# EAGLE design hemisphere_robo (EAGLE 8.2.2)
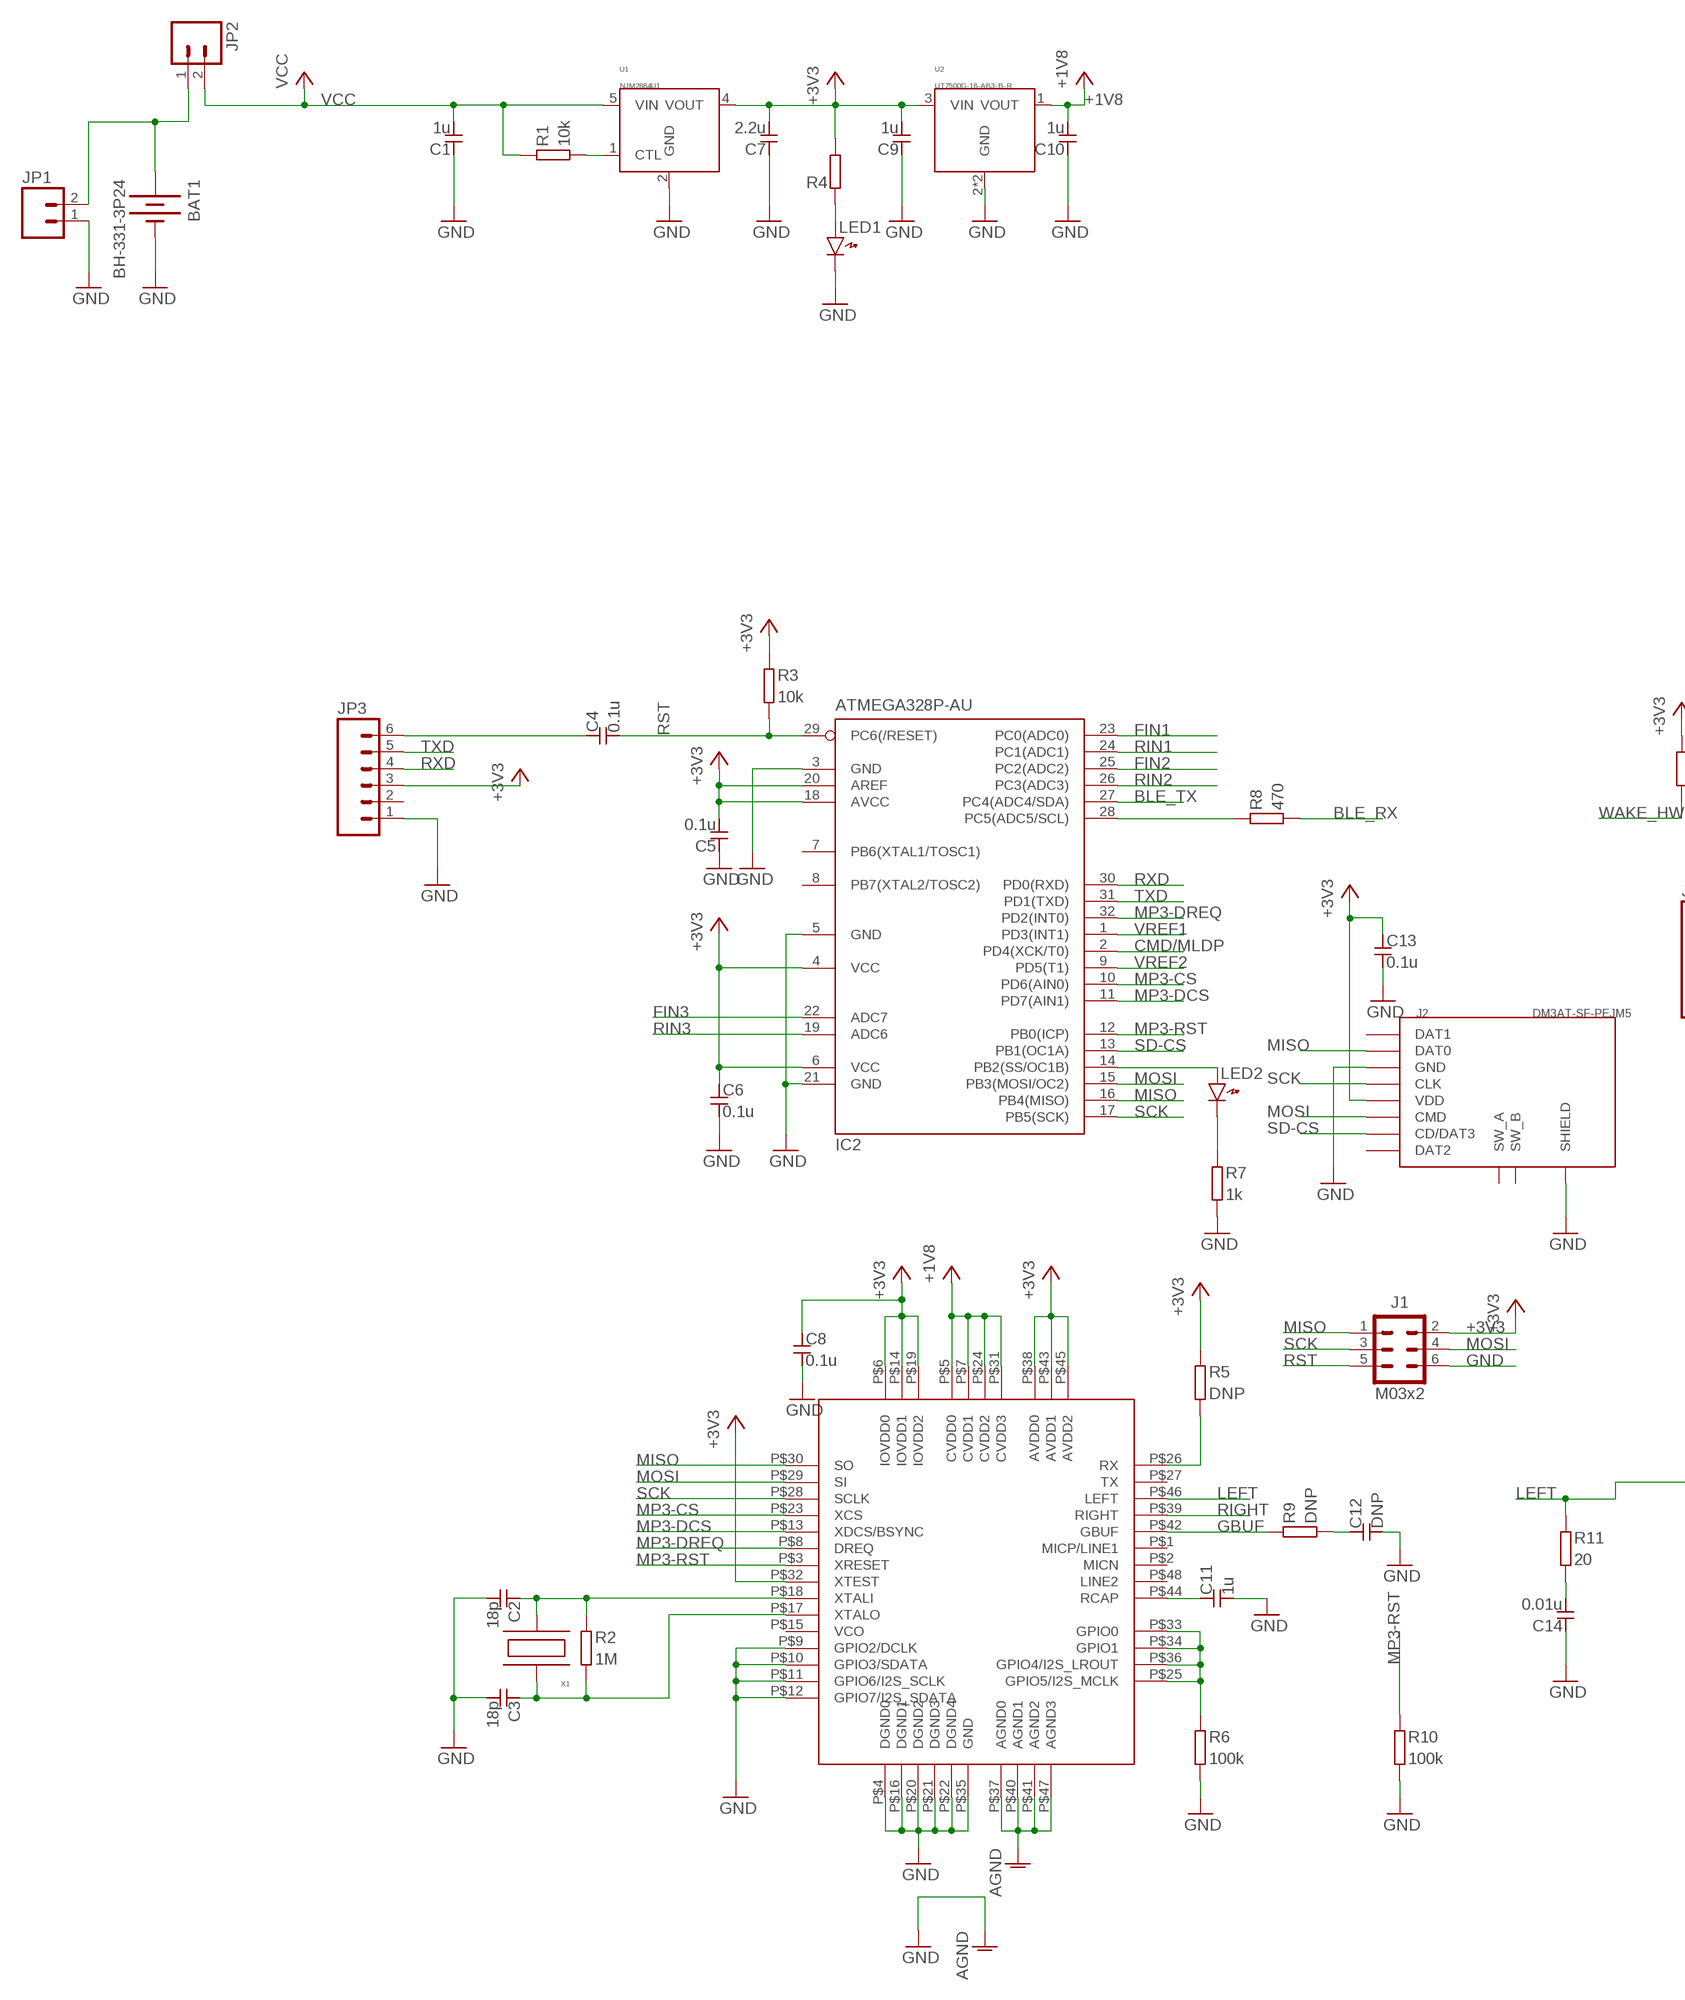
[diagram p0: schematic, sheet 1, part 1 of 2]
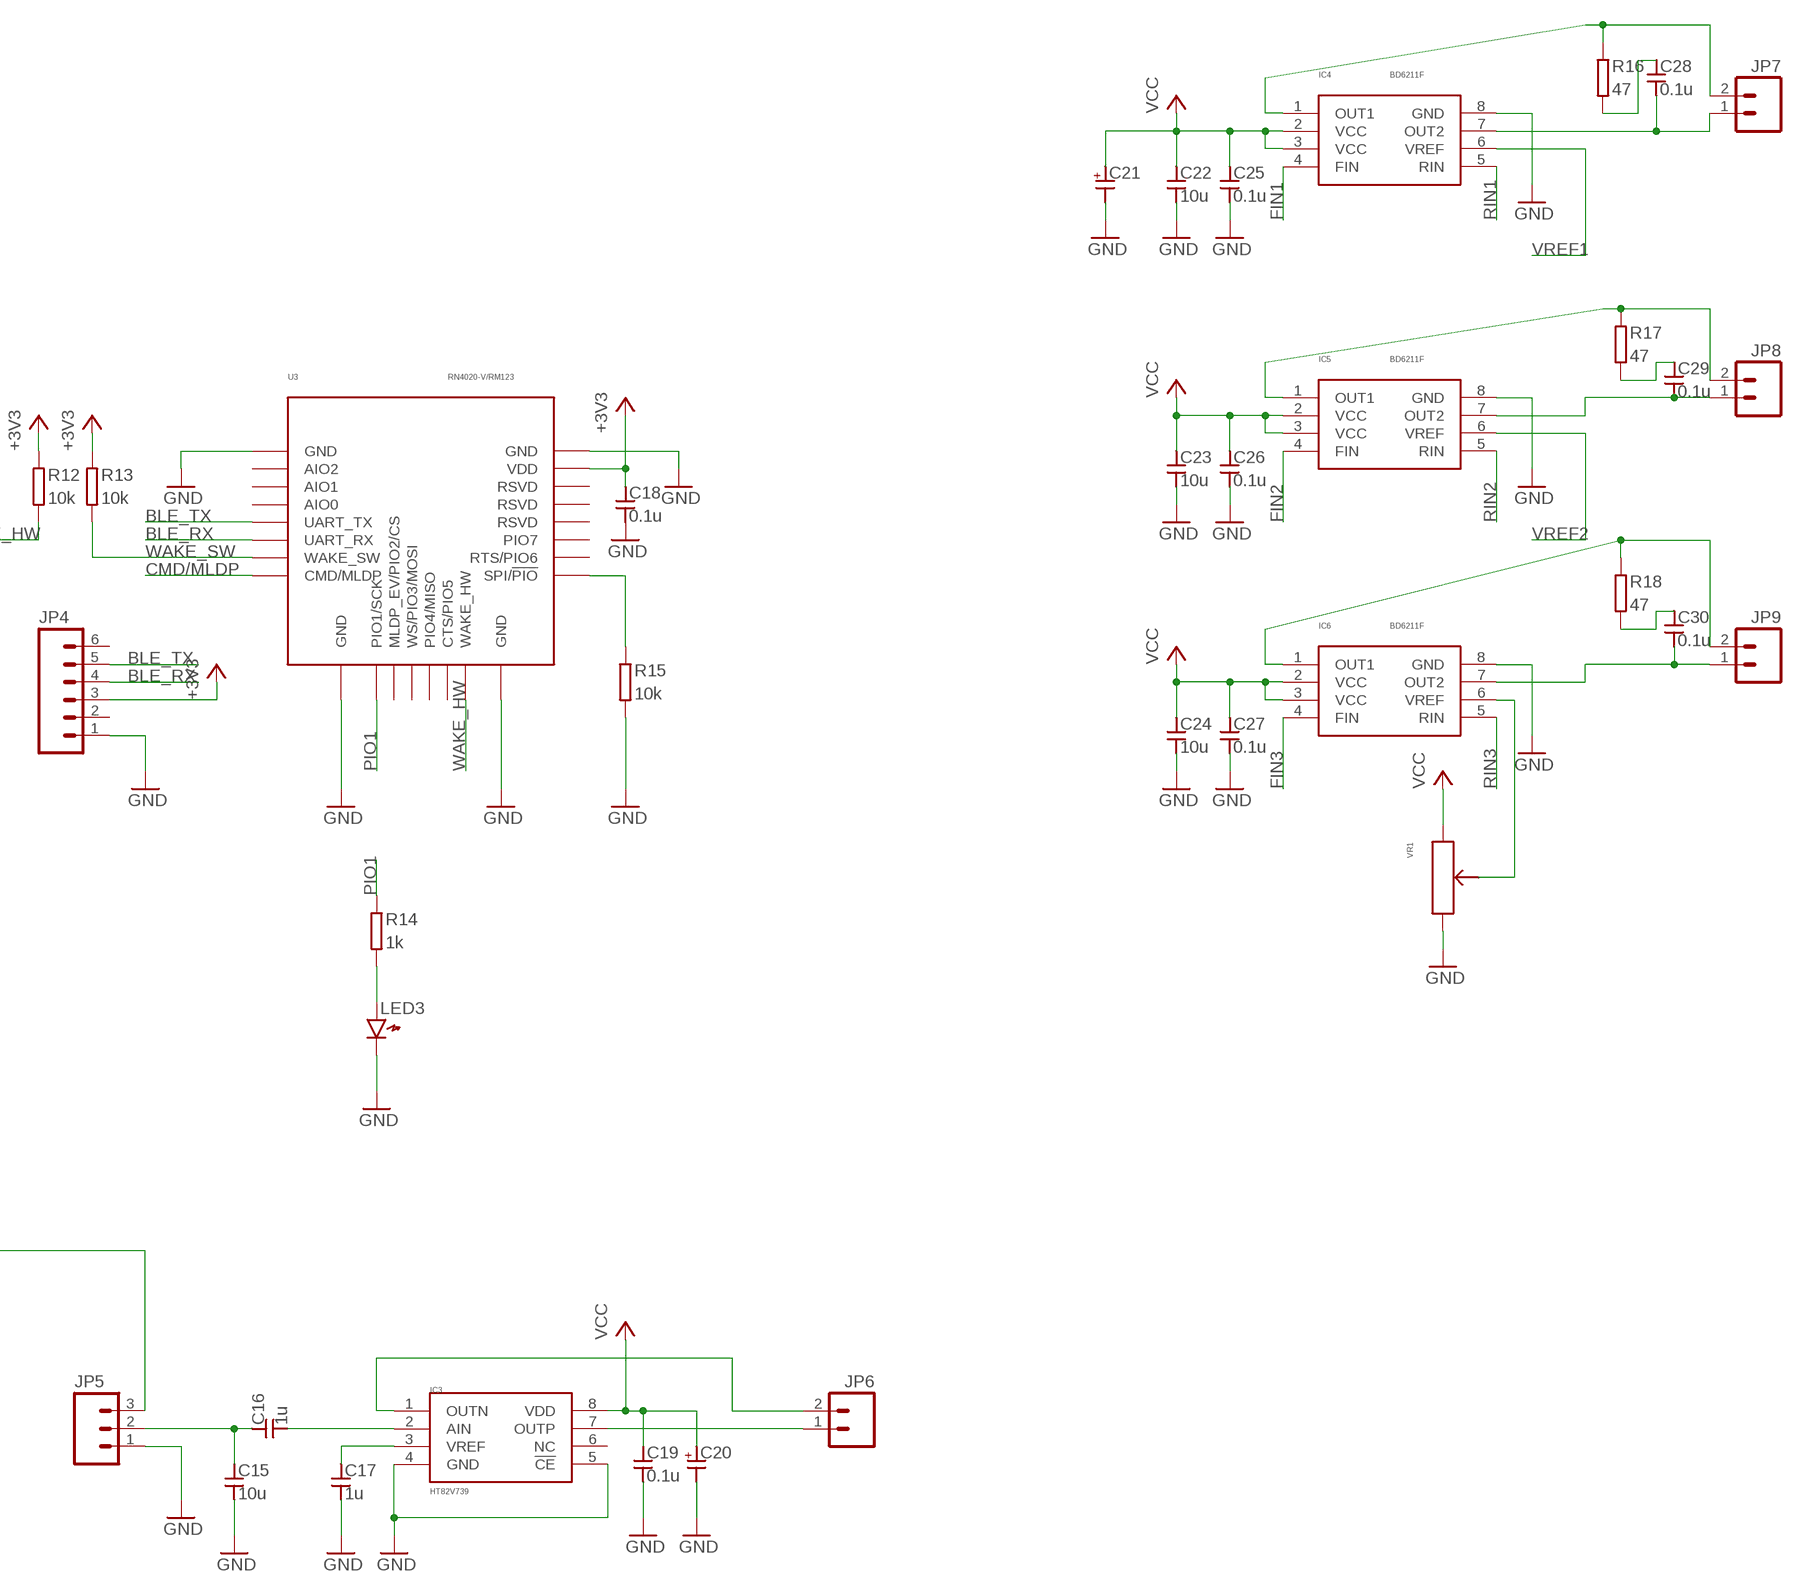
[diagram p1: schematic, sheet 1, part 2 of 2]

## Parts
BAT1  BH-331-3P24  [BH-331-3P24]
C1  1u  CAPACITOR1608_REDUCED  [SMD1608_REDUCED]
C2  18p  CAPACITOR1608_REDUCED  [SMD1608_REDUCED]
C3  18p  CAPACITOR1608_REDUCED  [SMD1608_REDUCED]
C4  0.1u  CAPACITOR1608_REDUCED  [SMD1608_REDUCED]
C5  0.1u  CAPACITOR1608_REDUCED  [SMD1608_REDUCED]
C6  0.1u  CAPACITOR1608_REDUCED  [SMD1608_REDUCED]
C7  2.2u  CAPACITOR1608_REDUCED  [SMD1608_REDUCED]
C8  0.1u  CAPACITOR1608_REDUCED  [SMD1608_REDUCED]
C9  1u  CAPACITOR1608_REDUCED  [SMD1608_REDUCED]
C10  1u  CAPACITOR1608_REDUCED  [SMD1608_REDUCED]
C11  1u  CAPACITOR1608_REDUCED  [SMD1608_REDUCED]
C12  DNP  CAPACITOR1608_REDUCED  [SMD1608_REDUCED]
C13  0.1u  CAPACITOR1608_REDUCED  [SMD1608_REDUCED]
C14  0.01u  CAPACITOR1608_REDUCED  [SMD1608_REDUCED]
C15  10u  CAPACITOR2012_REDUCED  [SMD2012_REDUCED]
C16  1u  CAPACITOR1608_REDUCED  [SMD1608_REDUCED]
C17  1u  CAPACITOR1608_REDUCED  [SMD1608_REDUCED]
C18  0.1u  CAPACITOR1608_REDUCED  [SMD1608_REDUCED]
C19  0.1u  CAPACITOR1608_REDUCED  [SMD1608_REDUCED]
C20  CAPACITOR-POLPANASONIC_D  [PANASONIC_D]
C21  CAPACITOR-POLPANASONIC_D  [PANASONIC_D]
C22  10u  CAPACITOR2012_REDUCED  [SMD2012_REDUCED]
C23  10u  CAPACITOR2012_REDUCED  [SMD2012_REDUCED]
C24  10u  CAPACITOR2012_REDUCED  [SMD2012_REDUCED]
C25  0.1u  CAPACITOR1608_REDUCED  [SMD1608_REDUCED]
C26  0.1u  CAPACITOR1608_REDUCED  [SMD1608_REDUCED]
C27  0.1u  CAPACITOR1608_REDUCED  [SMD1608_REDUCED]
C28  0.1u  CAPACITOR1608_REDUCED  [SMD1608_REDUCED]
C29  0.1u  CAPACITOR1608_REDUCED  [SMD1608_REDUCED]
C30  0.1u  CAPACITOR1608_REDUCED  [SMD1608_REDUCED]
IC1  VS1053B  [LQFP48]
IC2  ATMEGA328P-AU  [TQFP32-08]
IC3  HT82V739  [DIP8]
IC4  BD6211F  [SOP-8]
IC5  BD6211F  [SOP-8]
IC6  BD6211F  [SOP-8]
J1  M03X2STD  [2X03]
J2  DM3AT-SF-PEJM5  [DM3AT-SF-PEJM5]
JP1  M02NOSILK  [1X02-NOSILK]
JP2  M02NOSILK  [1X02-NOSILK]
JP3  M06NOSILK  [1X06-NOSILK]
JP4  M06NOSILK  [1X06-NOSILK]
JP5  M03NOSILK  [1X03-NOSILK]
JP6  M02NOSILK  [1X02-NOSILK]
JP7  M02NOSILK  [1X02-NOSILK]
JP8  M02NOSILK  [1X02-NOSILK]
JP9  M02NOSILK  [1X02-NOSILK]
LED1  LED1608_REDUCED  [LED1608_REDUCED]
LED2  LED1608_REDUCED  [LED1608_REDUCED]
LED3  LED1608_REDUCED  [LED1608_REDUCED]
R1  10k  RESISTOR1608_REDUCED  [SMD1608_REDUCED]
R2  1M  RESISTOR1608_REDUCED  [SMD1608_REDUCED]
R3  10k  RESISTOR1608_REDUCED  [SMD1608_REDUCED]
R4  RESISTOR1608_REDUCED  [SMD1608_REDUCED]
R5  DNP  RESISTOR1608_REDUCED  [SMD1608_REDUCED]
R6  100k  RESISTOR1608_REDUCED  [SMD1608_REDUCED]
R7  1k  RESISTOR1608_REDUCED  [SMD1608_REDUCED]
R8  470  RESISTOR1608_REDUCED  [SMD1608_REDUCED]
R9  DNP  RESISTOR1608_REDUCED  [SMD1608_REDUCED]
R10  100k  RESISTOR1608_REDUCED  [SMD1608_REDUCED]
R11  20  RESISTOR1608_REDUCED  [SMD1608_REDUCED]
R12  10k  RESISTOR1608_REDUCED  [SMD1608_REDUCED]
R13  10k  RESISTOR1608_REDUCED  [SMD1608_REDUCED]
R14  1k  RESISTOR1608_REDUCED  [SMD1608_REDUCED]
R15  10k  RESISTOR1608_REDUCED  [SMD1608_REDUCED]
R16  47  RESISTOR1608_REDUCED  [SMD1608_REDUCED]
R17  47  RESISTOR1608_REDUCED  [SMD1608_REDUCED]
R18  47  RESISTOR1608_REDUCED  [SMD1608_REDUCED]
U1  NJM2884U1  [SOT-89-5]
U2  UT7500G-18-AB3-B-R  [SOT-89]
U3  RN4020-V/RM123  [RN4020]
VR1  VR  [3362P]
X1  ABM2  [ABM2]

## Nets
+1V8: C10.2 IC1.P$5(CVDD0) IC1.P$7(CVDD1) IC1.P$24(CVDD2) IC1.P$31(CVDD3) U2.1(VOUT)
+3V3: C5.2 C6.1 C7.2 C8.1 C9.2 C13.1 C18.1 IC1.P$6(IOVDD0) IC1.P$14(IOVDD1) IC1.P$19(IOVDD2) IC1.P$32(XTEST) IC1.P$38(AVDD0) IC1.P$43(AVDD1) IC1.P$45(AVDD2) IC2.4(VCC) IC2.6(VCC) IC2.18(AVCC) IC2.20(AREF) J1.2 J2.4(VDD)(VDD) JP3.3 JP4.3 R3.1 R4.2 R5.1 R12.1 R13.1 U1.4(VOUT) U2.3(VIN) U3.23(VDD)
BLE_RX: JP4.4 R8.2 U3.6(UART_RX)
BLE_TX: IC2.27(PC4(ADC4/SDA)) JP4.5 U3.5(UART_TX)
CMD/MLDP: IC2.2(PD4(XCK/T0)) U3.8(CMD/MLDP)
FIN1: IC2.23(PC0(ADC0)) IC4.4(FIN)
FIN2: IC2.25(PC2(ADC2)) IC5.4(FIN)
FIN3: IC2.22(ADC7) IC6.4(FIN)
GBUF: IC1.P$42(GBUF) R9.1
GND: BAT1.- C1.1 C2.2 C3.2 C5.1 C6.2 C7.1 C8.2 C9.1 C10.1 C11.2 C12.2 C13.2 C14.1 C15.2 C17.2 C18.2 C19.2 C20.- C21.- C22.2 C23.2 C24.2 C25.2 C26.2 C27.2 IC1.P$4(DGND0) IC1.P$9(GPIO2/DCLK) IC1.P$10(GPIO3/SDATA) IC1.P$11(GPIO6/I2S_SCLK) IC1.P$12(GPIO7/I2S_SDATA) IC1.P$16(DGND1) IC1.P$20(DGND2) IC1.P$21(DGND3) IC1.P$22(DGND4) IC1.P$35(GND) IC1.P$37(AGND0) IC1.P$40(AGND1) IC1.P$41(AGND2) IC1.P$47(AGND3) IC2.3(GND) IC2.5(GND) IC2.21(GND) IC3.4(GND) IC3.5(!CE) IC4.8(GND) IC5.8(GND) IC6.8(GND) J1.6 J2.6(GND)(GND) J2.SHIELD@1(SHIELD) J2.SHIELD@2(SHIELD) J2.SHIELD@3(SHIELD) J2.SHIELD@4(SHIELD) JP1.1 JP3.1 JP4.1 JP5.1 LED1.K LED3.K R6.2 R7.2 R10.2 R15.2 U1.2(GND) U2.2(GND) U2.4(GND) U3.1(GND) U3.9(GND) U3.16(GND) U3.24(GND) VR1.3 ; supply symbol labelled AGND
LEFT: IC1.P$46(LEFT) JP5.3 R11.1
MISO: IC1.P$30(SO) IC2.16(PB4(MISO)) J1.1 J2.7(DAT0)(DAT0)
MOSI: IC1.P$29(SI) IC2.15(PB3(MOSI/OC2)) J1.4 J2.3(CMD)(CMD)
MP3-CS: IC1.P$23(XCS) IC2.10(PD6(AIN0))
MP3-DCS: IC1.P$13(XDCS/BSYNC) IC2.11(PD7(AIN1))
MP3-DREQ: IC1.P$8(DREQ) IC2.32(PD2(INT0))
MP3-RST: IC1.P$3(XRESET) IC2.12(PB0(ICP)) R10.1
N$1: IC2.14(PB2(SS/OC1B)) LED2.A
N$2: C4.1 JP3.6
N$3: LED3.A R14.2
N$4: IC2.28(PC5(ADC5/SCL)) R8.1
N$5: IC6.1(OUT1) JP9.2 R18.1
N$6: IC1.P$25(GPIO5/I2S_MCLK) IC1.P$33(GPIO0) IC1.P$34(GPIO1) IC1.P$36(GPIO4/I2S_LROUT) R6.1
N$10: C11.1 IC1.P$44(RCAP)
N$11: R15.1 U3.17(SPI/!PIO)
N$12: IC1.P$26(RX) R5.2
N$13: BAT1.+ JP1.2 JP2.1
N$14: IC3.7(OUTP) JP6.1
N$15: C2.1 IC1.P$18(XTALI) R2.1 X1.2
N$16: C14.2 R11.2
N$17: C12.1 R9.2
N$18: R1.2 U1.1(CTL)
N$19: C3.1 IC1.P$17(XTALO) R2.2 X1.1
N$20: C30.2 IC6.7(OUT2) JP9.1
N$21: IC6.6(VREF) VR1.2
N$22: C17.1 IC3.3(VREF)
N$23: C16.2 IC3.2(AIN)
N$24: C15.1 C16.1 JP5.2
N$25: C28.1 R16.2
N$26: C29.1 R17.2
N$27: C30.1 R18.2
N$29: IC3.1(OUTN) JP6.2
N$31: LED1.A R4.1
N$37: IC5.1(OUT1) JP8.2 R17.1
N$38: C29.2 IC5.7(OUT2) JP8.1
N$39: IC4.1(OUT1) JP7.2 R16.1
N$40: C28.2 IC4.7(OUT2) JP7.1
PIO1: R14.1 U3.10(PIO1/SCK)
RIGHT: IC1.P$39(RIGHT)
RIN1: IC2.24(PC1(ADC1)) IC4.5(RIN)
RIN2: IC2.26(PC3(ADC3)) IC5.5(RIN)
RIN3: IC2.19(ADC6) IC6.5(RIN)
RST: C4.2 IC2.29(PC6(/RESET)) J1.5 R3.2
RXD: IC2.30(PD0(RXD)) JP3.4
SCK: IC1.P$28(SCLK) IC2.17(PB5(SCK)) J1.3 J2.5(CLK)(CLK)
SD-CS: IC2.13(PB1(OC1A)) J2.2(CD/DAT3)(CD/DAT3)
SHUTDOWN: LED2.K R7.1
TXD: IC2.31(PD1(TXD)) JP3.5
VCC: C1.2 C19.1 C20.+ C21.+ C22.1 C23.1 C24.1 C25.1 C26.1 C27.1 IC3.8(VDD) IC4.2(VCC) IC4.3(VCC) IC5.2(VCC) IC5.3(VCC) IC6.2(VCC) IC6.3(VCC) JP2.2 R1.1 U1.5(VIN) VR1.1
VREF1: IC2.1(PD3(INT1)) IC4.6(VREF)
VREF2: IC2.9(PD5(T1)) IC5.6(VREF)
WAKE_HW: R12.2 U3.15(WAKE_HW)
WAKE_SW: R13.2 U3.7(WAKE_SW)
Unconnected: IC1.P$1(MICP/LINE1) IC1.P$2(MICN) IC1.P$15(VCO) IC1.P$27(TX) IC1.P$48(LINE2) IC2.7(PB6(XTAL1/TOSC1)) IC2.8(PB7(XTAL2/TOSC2)) IC3.6(NC) J2.1(DAT2)(DAT2) J2.8(DAT1)(DAT1) J2.SW_A J2.SW_B JP3.2 JP4.2 JP4.6 U3.2(AIO2) U3.3(AIO1) U3.4(AIO0) U3.11(MLDP_EV/PIO2/CS) U3.12(WS/PIO3/MOSI) U3.13(PIO4/MISO) U3.14(CTS/PIO5) U3.18(RTS/PIO6) U3.19(PIO7) U3.20(RSVD) U3.21(RSVD) U3.22(RSVD)

## Library data of the parts
BAT1 = battery:BH-331-3P24
C1-C19 C22-C30 = generic:CAPACITOR: Generic Capacitor
C20 C21 = generic:CAPACITOR-POL: Generic Capacitor with Polarity
IC1 = MP3:VS1053B
IC2 = AVR:ATMEGA328P-AU: AVR ATMEGA328P-AU AKIZUKI CODE I-04386
IC3 = audio_amp:HT82V739
IC4-IC6 = motor_driver:BD6211: ROHM Motor driver
J1 = header:M03X2
J2 = SDcard:DM3AT
JP1 JP2 JP6-JP9 = header:M02
JP3 JP4 = header:M06
JP5 = header:M03
LED1-LED3 = generic:LED: Generic LEDs
R1-R18 = generic:RESISTOR: Generic Registor
U1 = LDO:NJM2884U1: JRC LDO Io(max ) = 500mA akizuki : I-10896
U2 = LDO:UT7500G: LDO Io: 100mA
U3 = com_module:RN4020: Bluetooth Low Energy Module Microchip
VR1 = VR:VR
X1 = crystal:ABM2: ABRACON Crystal

## Board
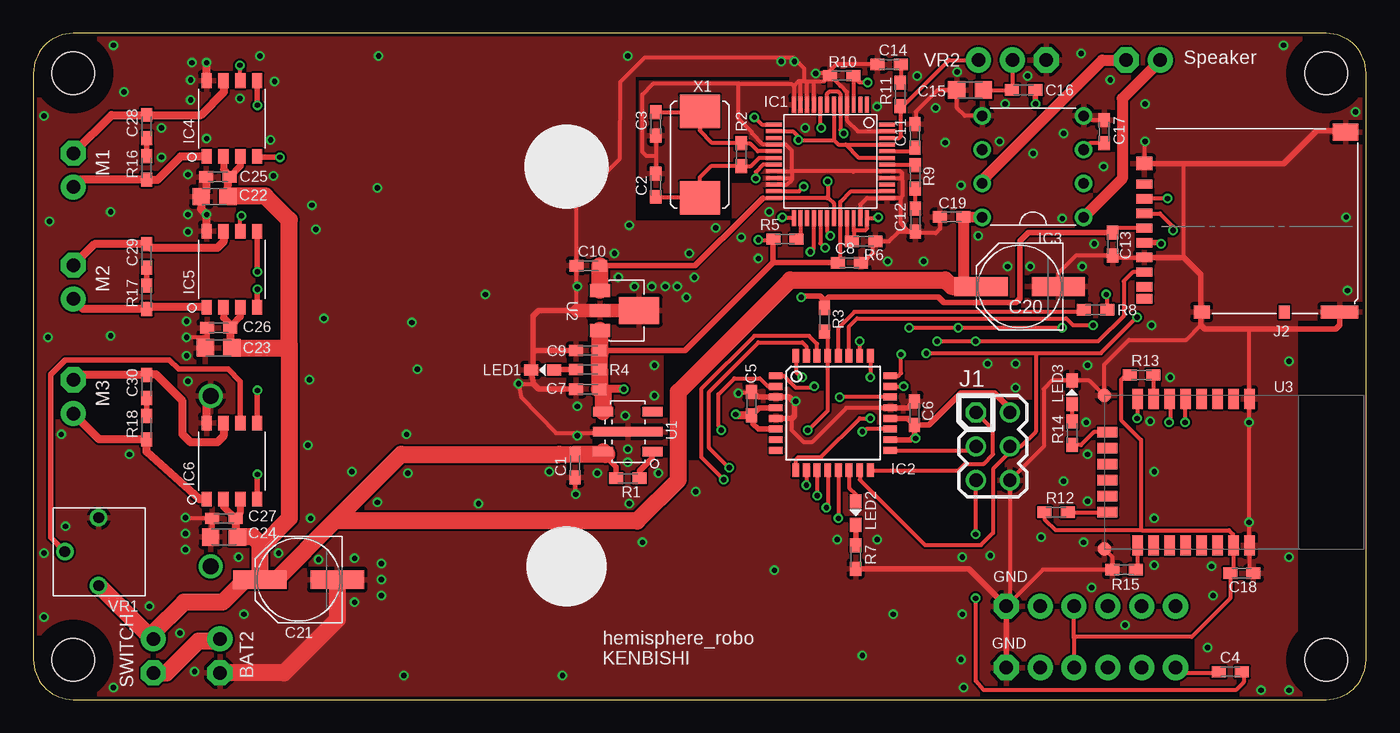
[diagram p2: board, top side]
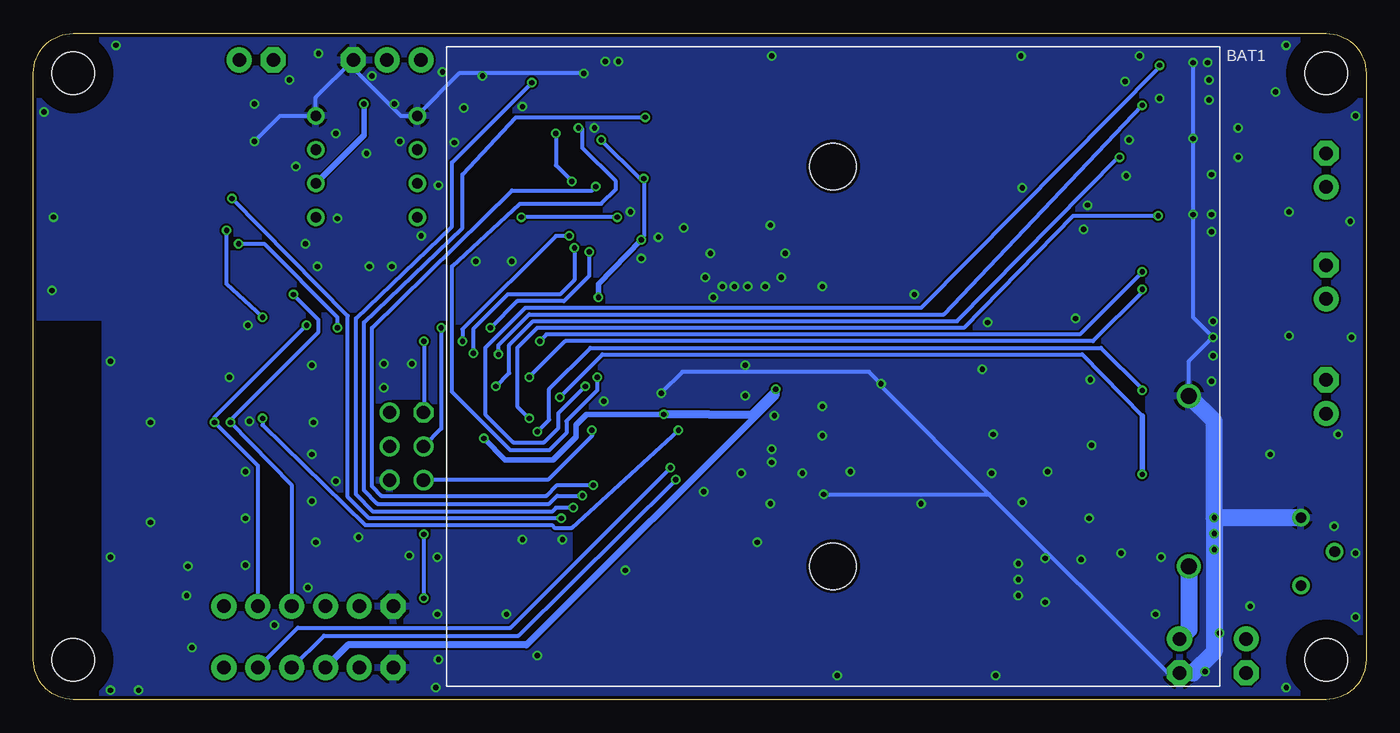
[diagram p3: board, bottom side, seen from below]

Size 100 x 50 mm. Coordinates in mm from the lower left corner, seen from the top.
Outline: 0,47 0,3 arc90 3,0 97,0 arc90 100,3 100,47 arc90 97,50 3,50 arc90 0,47
Copper layers (1*16): Top 0.035mm / dielectric 1.5mm / Bottom 0.035mm
Design rules "Elecrow_2-layer_eagle_rule": minimum track width 6mil, minimum drill 10mil, track to track 6mil, track to pad 6mil, pad to pad 6mil, via to via 6mil, smd to smd 0mil, copper to edge 10mil, drill to drill 10mil, minimum pad ring 10mil, minimum via ring 6mil, stop-mask expansion 2mil, vias tented up to drill 0.5mm, thermal gap 10mil
Holes 3.2 mm at 3,3 3,47 97,47 97,3
tRestrict: area 0,44 to 6,50; area 0,0 to 6,6; area 94,0 to 100,6; area 94,44 to 100,50; area 45.2,36 to 45.4,46.5; area 45.4,36 to 52.4,36.1; area 52.3,36.1 to 52.4,39; area 52.4,38.8 to 53.6,39; area 45.2,46.5 to 56.7,46.7; area 57.2,44.4 to 57.4,44.9; area 57.7,44.4 to 57.9,44.9; area 58.2,44.4 to 58.4,44.9; 13 more areas
bRestrict: area 0,44 to 6,50; area 0,0 to 6,6; area 94,0 to 100,6; area 94,44 to 100,50; area 18.5,41.1 to 18.6,42.3; area 59.3,10.7 to 59.5,12.6; area 71.5,19.5 to 71.6,21.1; area 72.5,19.4 to 72.6,21; area 94.9,22.7 to 99.8,28.4; area 94.9,4.5 to 100,11.4; area 66.3,16.8 to 66.5,19.2; area 71,22.4 to 73.1,22.5; 3 more areas

### Footprints (pad centres in the part's own frame; a part is rotated, then mirrored left to right if it is on the bottom)
BH-331-3P24 = drill 1.2: + 26.7,-15; - 26.7,-2.2 | hole 3.5: 0,-15; 0,15
SMD1608_REDUCED = smd 1.05 x 0.85: 1 -0.875,0; 2 0.875,0
SMD2012_REDUCED = smd 1.3 x 1.3: 1 -1,0; 2 1,0
PANASONIC_D = smd 4 x 1.4: + 2.9,0; - -2.9,0
LQFP48 = smd 0.3 x 1.2: P$1 -2.75,-4.25; P$2 -2.25,-4.25; P$3 -1.75,-4.25; P$4 -1.25,-4.25; P$5 -0.75,-4.25; P$6 -0.25,-4.25; P$7 0.25,-4.25; P$8 0.75,-4.25; P$9 1.25,-4.25; P$10 1.75,-4.25; P$11 2.25,-4.25; P$12 2.75,-4.25; P$25 2.75,4.25; P$26 2.25,4.25; P$27 1.75,4.25; P$28 1.25,4.25; P$29 0.75,4.25; P$30 0.25,4.25; P$31 -0.25,4.25; P$32 -0.75,4.25; P$33 -1.25,4.25; P$34 -1.75,4.25; P$35 -2.25,4.25; P$36 -2.75,4.25 | smd 1.2 x 0.3: P$13 4.25,-2.75; P$14 4.25,-2.25; P$15 4.25,-1.75; P$16 4.25,-1.25; P$17 4.25,-0.75; P$18 4.25,-0.25; P$19 4.25,0.25; P$20 4.25,0.75; P$21 4.25,1.25; P$22 4.25,1.75; P$23 4.25,2.25; P$24 4.25,2.75; P$37 -4.25,2.75; P$38 -4.25,2.25; P$39 -4.25,1.75; P$40 -4.25,1.25; P$41 -4.25,0.75; P$42 -4.25,0.25; P$43 -4.25,-0.25; P$44 -4.25,-0.75; P$45 -4.25,-1.25; P$46 -4.25,-1.75; P$47 -4.25,-2.25; P$48 -4.25,-2.75
TQFP32-08 = smd 1.016 x 0.508: 1 -4.293,2.8; 2 -4.293,2; 3 -4.293,1.2; 4 -4.293,0.4; 5 -4.293,-0.4; 6 -4.293,-1.2; 7 -4.293,-2; 8 -4.293,-2.8; 17 4.293,-2.8; 18 4.293,-2; 19 4.293,-1.2; 20 4.293,-0.4; 21 4.293,0.4; 22 4.293,1.2; 23 4.293,2; 24 4.293,2.8 | smd 0.508 x 1.016: 9 -2.8,-4.293; 10 -2,-4.293; 11 -1.2,-4.293; 12 -0.4,-4.293; 13 0.4,-4.293; 14 1.2,-4.293; 15 2,-4.293; 16 2.8,-4.293; 25 2.8,4.293; 26 2,4.293; 27 1.2,4.293; 28 0.4,4.293; 29 -0.4,4.293; 30 -1.2,4.293; 31 -2,4.293; 32 -2.8,4.293
DIP8 = drill 0.8: 1 -3.81,3.81; 2 -3.81,1.27; 3 -3.81,-1.27; 4 -3.81,-3.81; 5 3.81,-3.81; 6 3.81,-1.27; 7 3.81,1.27; 8 3.81,3.81
SOP-8 = smd 1.1 x 0.76: 1 -2.85,1.905; 2 -2.85,0.635; 3 -2.85,-0.635; 4 -2.85,-1.905; 5 2.85,-1.905; 6 2.85,-0.635; 7 2.85,0.635; 8 2.85,1.905
2X03 = drill 1 octagon: 1 -1.27,2.54 | drill 1: 2 1.27,2.54; 3 -1.27,0; 4 1.27,0; 5 -1.27,-2.54; 6 1.27,-2.54
DM3AT-SF-PEJM5 = smd 0.7 x 1.2: 1(DAT2) 0,0.6; 2(CD/DAT3) -1.1,0.6; 3(CMD) -2.2,0.6; 4(VDD) -3.3,0.6; 5(CLK) -4.4,0.6; 6(GND) -5.5,0.6; 7(DAT0) -6.6,0.6; 8(DAT1) -7.7,0.6; SW_B -8.6,0.6 | smd 1 x 2.8: SHIELD@1 -9.6,-14.05 | smd 1.3 x 1.9: SHIELD@2 3.9,-14.5 | smd 1 x 1.2: SHIELD@3 1.55,0.6; SHIELD@4 -9.6,-3.7 | smd 1 x 0.8: SW_A -9.6,-9.9
1X02-NOSILK = drill 1.016 pad 1.88 octagon: 1 0,0 | drill 1.016 pad 1.88: 2 2.54,0
1X06-NOSILK = drill 1.016 pad 1.88 octagon: 1 0,0 | drill 1.016 pad 1.88: 2 2.54,0; 3 5.08,0; 4 7.62,0; 5 10.16,0; 6 12.7,0
1X03-NOSILK = drill 1.016 pad 1.88 octagon: 1 0,0 | drill 1.016 pad 1.88: 2 2.54,0; 3 5.08,0
LED1608_REDUCED = smd 1.05 x 0.85: A -0.875,0; K 0.875,0
SOT-89-5 = smd 0.7 x 1.5: 1 -1.5,-1.85; 3 1.5,-1.85; 4 1.5,1.85; 5 -1.5,1.85 | smd 0.7 x 5.2: 2 0,0
SOT-89 = smd 1 x 1.5: 1 -1.5,-2; 2 0,-2; 3 1.5,-2 | smd 2 x 3: 4 0,0.95
RN4020 = smd 1.5 x 0.8: 1 0.25,10.9; 2 0.25,9.7; 3 0.25,8.5; 4 0.25,7.3; 5 0.25,6.1; 6 0.25,4.9; 7 0.25,3.7; 8 0.25,2.5; 17 11.25,2.5; 18 11.25,3.7; 19 11.25,4.9; 20 11.25,6.1; 21 11.25,7.3; 22 11.25,8.5; 23 11.25,9.7; 24 11.25,10.9 | smd 1 x 1: 9 0,0; 16 11.5,0 | smd 0.8 x 1.5: 10 2.75,0.25; 11 3.95,0.25; 12 5.15,0.25; 13 6.35,0.25; 14 7.55,0.25; 15 8.75,0.25
3362P = drill 0.8: 1 0,2.54; 2 2.54,0; 3 0,-2.54
ABM2 = smd 2.5 x 3: 1 -3.25,0; 2 3.25,0

### Placement (x,y rotation side)
BAT1  40,25 0 bottom
C1  40.64,17.55 90 top
C2  46.7,38.6 90 top
C3  46.7,43.2 270 top
C4  89.81,2.08 0 top
C5  53.88,22.2 270 top
C6  66.1,21.5 90 top
C7  41.6,23.3 0 top
C8  61.23,32.78 0 top
C9  41.6,26.2 0 top
C10  41.63,32.56 0 top
C11  66.14,42.29 90 top
C12  66.18,35.98 270 top
C13  80.98,34.18 270 top
C14  64.21,47.66 0 top
C15  70.28,45.74 180 top
C16  74.31,45.76 0 top
C17  80.34,42.62 90 top
C18  90.67,9.48 0 top
C19  68.91,36.22 180 top
C20  74,31 180 top
C21  19.9,9 180 top
C22  13.59,37.74 180 top
C23  13.9,26.4 180 top
C24  14.3,12.2 180 top
C25  13.85,39.22 180 top
C26  13.9,27.9 180 top
C27  14.3,13.6 180 top
C28  8.5,43 90 top
C29  8.5,33.3 90 top
C30  8.5,23.5 90 top
IC1  59.8,40.4 180 top
IC2  60,21.5 0 top
IC3  75,40 180 top
IC4  14.9,43.6 90 top
IC5  14.9,32.3 90 top
IC6  14.9,17.9 90 top
J1  72,19 0 top
J2  83.96,38.68 90 top
JP1  14,2 90 top
JP2  9,2 90 top
JP3  73,2.4 0 top
JP4  73,7 0 top
JP5  76,48 180 top
JP6  82,48 0 top
JP7  3,41 270 top
JP8  3,32.6 270 top
JP9  3,24 270 top
LED1  38.2,24.73 180 top
LED2  61.7,14 270 top
LED3  77.93,23.06 90 top
R1  44.6,16.6 0 top
R2  53.1,40.9 90 top
R3  59.36,28.5 270 top
R4  41.59,24.77 0 top
R5  56.39,34.56 0 top
R6  62.3,34.4 0 top
R7  61.7,10.7 270 top
R8  79.7,29.26 0 top
R9  66.16,39.22 270 top
R10  60.66,46.82 180 top
R11  65.04,45.42 90 top
R12  76.74,14.06 0 top
R13  83.15,24.36 0 top
R14  77.94,19.98 90 top
R15  81.84,9.74 180 top
R16  8.5,39.9 90 top
R17  8.5,30.2 90 top
R18  8.5,20.4 90 top
U1  44.6,20.1 90 top
U2  44.5,29.2 270 top
U3  80.34,22.82 270 top
VR1  4.9,11.1 180 top
X1  50,40.9 270 top

### Tracks (layer width: path | path; a pad name or v marks a point on that pad's centre or on a via)
+1V8  (via drill 0.4)
  Top 0.305: 54.75,37.65 IC1.P$24 59.49,37.65 | IC1.P$31 60.05,37.25 59.65,37.65 59.49,37.65 | IC1.P$7 59.55,45.45 59.7,45.6 60.4,45.6 60.55,45.45 IC1.P$5 60.55,42.75 v60.8,42.5 | v59.6,38.9 59.6,37.76 59.49,37.65
  Top 0.406: C10.2 49.66,32.56 53.7,36.6 54.75,37.65
  Top 1.27: U2.1 42.5,32.45 C10.2
  Bottom 0.305: v60.8,42.5 60.8,40.1 v59.6,38.9
+3V3  (via drill 0.4)
  Top 0.305: C8.1 60.5,32.92 60.5,33 60.49,32.9 60.49,32.85 60.55,33.11 IC1.P$32 60.55,37.35 61.35,38.15 IC1.P$38 | IC1.P$14 56.98,42.65 57.4,42.23 v57.4,42 60.05,42 | 60.95,41.65 IC1.P$45 | IC1.P$43 61.95,40.65 60.95,41.65 | IC1.P$19 54.75,40.15 54.2,39.6 v54.2,39.1 | v54.4,34.5 55.27,34.5 R5.1 | v66.2,19.6 66.16,19.6 66.03,19.73 | J2.4(VDD) 80.91,35.38 C13.1 | 59.33,29.32 R3.1 | 78.08,4.59 JP3.3 | 78.08,4.59 JP4.3 | 78.08,4.59 78.19,4.7 86.9,4.7 89.8,7.59 C18.1 90.04,9.72 U3.23 90,11.61 90,12.4 89.7,12.7 83.17,12.7 | R12.1 75.86,13.54 76.7,12.7 83.17,12.7 | R13.1 81.96,24.36 81.6,24 81.6,21 83.1,19.5 83.1,12.77 83.17,12.7 | IC1.P$6 60.05,42 | 60.05,42 60.4,41.65 60.95,41.65
  Top 0.406: IC2.4 54.45,21.9 C5.2 54,21.41 54,20.7 54.4,20.3 IC2.6 | IC2.20 65.62,21.1 C6.1 66.1,20.51 | IC2.18 65.8,19.5 66.03,19.73 66.1,19.8 66.1,20.51 | J1.2 73.27,21.83 72.1,23 69.6,23 67.2,20.6 66.19,20.6 66.1,20.51 | C13.1 74.66,35.05 74,34.4 74,30.1 73.7,29.8 68.3,29.8 67.9,30.2 59.7,30.2 59.33,29.82 59.33,29.32 | R3.1 59.36,29.94 59,30.3 57.6,30.3 v57.6,30.2 | C9.2 48.9,26.2 55.5,32.8 | 55.5,32.8 60.34,32.8 C8.1 | 55.5,32.8 55.5,34.55 R5.1
  Top 0.61: C5.2 52.83,21.32 v52.7,21.4 | v44.3,23.3 43.02,23.3 42.75,23.02
  Top 1.27: U1.4 42.75,23.02 C7.2 42.48,24.8 | 42.5,26.18 C9.2 | 42.48,24.8 42.48,25.8 42.5,26.18 | 42.5,26.18 U2.3 | R4.2 42.47,24.79 42.48,24.8
  Bottom 0.305: v57.4,42 54.5,39.1 v54.2,39.1 54.2,34.8 54.47,34.53 | JP3.3 78.02,2.48 77.98,2.52 | 49.5,21.36 49.36,21.4
  Bottom 0.406: v52.7,21.4 58.5,21.4 59.3,20.6 59.3,19.7 61,18 64.6,18 v66.2,19.6 | 54.47,34.53 v54.4,34.5 57.6,31.2 v57.6,30.2
  Bottom 0.508: v44.3,23.3 44.3,22.8 63,4.1 76.39,4.1 78.02,2.48
  Bottom 0.61: v52.7,21.4 49.36,21.4 46.1,21.4 44.3,23.2 v44.3,23.3
BLE_RX  (via drill 0.4)
  Top 0.305: U3.6 85.3,22.51 85.3,20.9 v85.2,20.8 | R8.2 80.58,30.12 v80.5,30.4
  Bottom 0.305: JP4.4 80.62,16.12 v85.2,20.8 85.2,21 78.6,27.6 78.6,28.5 v80.5,30.4
BLE_TX  (via drill 0.4)
  Top 0.305: U3.5 86.4,22.53 v86.4,20.8 | IC2.27 61.2,28 61.8,28.6 77.5,28.6 78,28.1 v79.5,28.1
  Bottom 0.305: JP4.5 83.16,17.56 v86.4,20.8 86.4,21.2 v79.5,28.1
CMD/MLDP  (via drill 0.4)
  Top 0.305: U3.8 82.84,21.14 v82.8,21.1 | v51.6,20.2 51.4,20.6 51.4,22.9 52.6,24.1 54.5,24.1 55.1,23.5 IC2.2
  Bottom 0.305: v82.8,21.1 82.8,20.6 75.1,13.1 61.1,13.1 60.9,12.9 59.6,12.9 v51.6,20.2
FIN1  (via drill 0.4)
  Top 0.305: IC2.23 v65.3,23.5
  Top 0.406: v18.5,40.7 16.86,40.7 IC4.4
  Bottom 0.305: v65.3,23.5 64.3,24.5 64.3,26.6 62.5,28.4 30.7,28.4 18.6,40.7
  Bottom 0.406: 18.6,40.7 v18.5,40.7
FIN2  (via drill 0.4)
  Top 0.305: IC2.25 v62.8,24.2
  Top 0.406: IC5.4 v16.8,30.8
  Bottom 0.305: v62.8,24.2 60.1,26.9 20.5,26.9 16.8,30.6 v16.8,30.8
FIN3  (via drill 0.4)
  Top 0.305: IC2.22 v60.5,22.7
  Top 0.406: v16.8,16.9 v16.8,16.89 IC6.4
  Bottom 0.305: v60.5,22.7 57.3,25.9 21.3,25.9 16.8,21.3
  Bottom 0.406: 16.8,21.3 v16.8,16.9
GBUF
  Top 0.305: IC1.P$42 66.11,40.15 R9.1
GND  (via drill 0.4)
  Top 0.305: C3.2 46.7,40.8 | 46.7,40.8 C2.2 | 56.9,39.17 56.9,39 56.55,38.65 IC1.P$22 | 56.9,39.61 56.9,39.64 | 56.9,39.61 56.9,39.17 | 56.9,39.64 56.9,41.2 56.45,41.65 IC1.P$16 54.75,41.65 53.9,42.5 53.9,42.6 52.9,43.6 52.9,46.13 52.97,46.2 | IC1.P$21 56.88,39.15 56.9,39.17 | IC1.P$20 56.89,39.65 56.9,39.64 | IC1.P$35 62.05,37.15 62.55,37.65 IC1.P$37 65.05,37.65 | IC1.P$47 61.85,42.65 61.05,43.45 IC1.P$4 61.05,45.6 60.59,46.06 60.55,46.06 R10.2 | C15.2 67.84,45.74 66.2,44.1 66.2,43.23 C11.2 | 69.3,45.76 C15.2 | 59.78,46.86 R10.2 | 59.78,46.86 59.78,47.19 60.3,47.7 63.3,47.7 C14.1 | IC3.5 69.89,43.81 69.3,44.4 69.3,45.72 C15.2 | 57.05,46.02 IC1.P$12 | 57.05,46.02 57.05,46.05 57.4,46.4 57.64,46.4 | 57.83,46.4 58.19,46.4 | 57.83,46.4 57.64,46.4 | 58.19,46.4 58.58,46.4 | IC1.P$11 57.55,46.31 57.64,46.4 | IC1.P$10 58.05,46.26 58.19,46.4 | IC1.P$9 58.55,46.37 58.58,46.4 | 58.58,46.4 59.33,46.4 59.78,46.86 | 65.2,38.99 65.2,37.8 65.05,37.65 | 65.2,38.99 65.2,39.5 65.05,39.65 IC1.P$41 61.55,39.65 | IC1.P$40 65.04,39.15 65.2,38.99 | 65.05,37.65 65.1,37.6 65.1,35.7 65.69,35.1 C12.2 | C12.2 64.9,35.1 64.2,34.4 R6.2 63,34.33 63,33.5 62.58,33.08 C8.2 | 73,6.95 73.27,7.21 J1.6 75.8,18.99 75.8,23.3 76.44,23.93 LED3.K 79.22,23.93 U3.9 80.34,25.14 82.2,27 86.5,27 87.6,28.1 | C18.2 91.24,9.79 U3.24 U3.1 91.24,27.84 90.38,27.8 | U3.16 80.97,10.7 R15.2 75.74,9.74 JP4.1 | 76.73,30.83 C20.- 76.9,32 78.2,33.3 C13.2 80.7,33.18 J2.6(GND) | C19.2 68.03,35.34 67.7,35 66.28,35 C12.2 | C17.2 79.12,43.49 IC3.4 | C5.1 53.7,23 v52.9,23 | 37.52,23.68 36.58,23.68 v36.4,23.7 36.6,22.7 39.2,20 44.5,20 U1.2 | IC2.21 61,21.9 58.4,19.3 57.8,19.3 56.9,20.2 56.9,21.1
  Top 0.305: C1.1 40.64,15.66 40.7,15.6 v40.7,15.4 | 46.7,40.8 46,40.8 45.7,41.1 45.7,45.4 46.5,46.2 52.97,46.2 | 52.97,46.2 56.87,46.2 57.05,46.02 | 40.81,29.2 40.76,29.25 C10.1 40.76,37.35 44,40.6 44.05,46.35 45.9,48.2 57,48.2 57.83,47.37 57.83,46.4 | 61.55,39.65 61.5,39.6 | 61.55,39.65 56.94,39.65 56.9,39.61 | J2.SHIELD@3 83.4,40.27 v83.4,41.9 | 86.32,33.18 86.33,33.19 86.33,40.23 | 12.99,47.7 13,47.7 v13,47.8 | v12.99,36.4 v13,36.4 | v11.5,27.2 12.93,27.2 13.03,27.3 | R10.2 59.6,47 v58.71,47 v58.7,47 | v11.4,13.64 11.45,13.6 C27.2
  Top 0.406: 12.53,37.74 C22.2 12.97,38.12 | 12.99,22.5 BAT1.- | C26.2 13.03,27.3 13.03,26.52 C23.2 | C27.2 13.43,12.32 C24.2 | C7.1 37.9,23.3 37.52,23.68 LED1.K 37.5,24.75 37.5,26 37.54,26.04 | C9.1 37.7,26.2 37.54,26.04 | 40.81,29.2 37.9,29.2 37.5,28.8 37.5,26.09 37.54,26.04 | C5.1 54.45,22.7 IC2.3 56.7,22.7 57.1,22.3 57.1,21.3 56.9,21.1 IC2.5 | IC2.21 65.62,21.9 C6.2 | R7.2 70.17,9.82 JP4.1 73,6.95 JP3.1 | J2.SHIELD@3 86.33,40.23 93.83,40.23 96.3,42.7 98.34,42.7 J2.SHIELD@2 | J2.6(GND) 86.32,33.18 87.6,31.9 87.6,29.14 J2.SHIELD@4 87.6,29.02 87.6,28.1 87.9,27.8 90.38,27.8 97.7,27.8 98.01,28.11 J2.SHIELD@1
  Top 0.61: IC6.8 12.99,22.5 | C25.2 12.97,38.12 | IC4.8 12.99,47.7 | C22.2 12.59,36.81 v13,36.4 | IC5.8 v12.99,36.4
  Top 1.016: U2.4 U2.2 40.81,29.2
  Top 1.27: C21.- 22.8,6 18.8,2 JP1.1
  Bottom 0.305: 71.25,43.8 72.4,43.8 76,47.4 JP5.1 78.81,45.19 IC3.4 81.49,43.81 v83.4,41.9 | 71.25,43.8 IC3.5 | v52.9,23 51.3,24.6 37.3,24.6 v36.4,23.7 36.5,23.6 28.3,15.4 | JP1.1 14.9,2 28.3,15.4 | v40.7,15.4 28.3,15.4 | v13,47.8 v13,36.4 13,28.7 v11.5,27.2 13.3,25.4 BAT1.- | v58.71,47 68.05,47 71.25,43.8
  Bottom 0.406: 73.27,7.27 JP4.1
  Bottom 1.27: JP1.1 13,2 11.4,3.6 v11.4,13.64 | v11.4,13.64 11.4,20.9 BAT1.- | VR1.3 v11.39,13.64 v11.4,13.64
  other vias: 28.4,28.3 20.9,37.1 18,39.3 17.8,42 15.5,45.1 13,42.1 11.9,47.8 11.8,46.5 11.6,36.4 11.6,35.1 21.2,35.3 21.8,28.6 11.5,28.4 11.6,39.4 11.5,25.8 11.6,23.9 2.1,19.9 0.8,6.2 6,0.9 69.8,0.9 92.1,0.7 94.2,0.7 94.2,10.7 88.4,10 84.1,10.1 81.9,5.6 84.1,13.6 84.1,17.1 91.2,20.8 91.2,13.3 83.8,20.9 85.3,24.2 83.9,28.1 79.1,25.1 79,20.8 79.1,18.4 77.3,16.4 79.1,14.9 73.7,25.2 71.6,25.2 73.7,23.4 74.8,32.5 79.6,34.2 78.7,32.5 73.1,32.5 70.9,34.8 80.8,46.5 77.3,42.5 75,41 80.3,40 83.4,44.7 93.8,49.1 99.2,44.1 78.6,48.5 66.3,46.8 67.7,44.4 72.9,44.7 72.5,41.9 69.6,38.6 68.4,41.8 63.3,44.5 51.2,35.4 55.2,36.6 53.1,34.7 49.2,33.5 54.4,33.1 43.9,31.7 49.6,31.7 43.6,33.5 44.7,35.6 44.6,48.3 33.9,30.4 25.8,38.4 18.1,46.4 5.8,36.6 6,49.1 0.8,43.8 11.8,45 9.6,42.9 9.6,40.7 5.8,27.3 1.1,27.2 1.2,35.9 0.8,11 2.4,13 7.2,18.4 8.7,7 11,5 15.8,6.4 12.1,2.1 39.7,1.8 27.8,1.8 26.1,10.2 26.1,9 26.1,7.8 24.1,10.6 21.4,10.5 18.4,11 20.8,13.6 20.7,24 40.8,19.8 40.8,22 44.4,21.3 44.6,17.8 44.6,18.8 42.3,17 46.9,17 28,19.9 23.9,17.1 20.6,19.1 28.8,24.8 49.7,15.6 45.7,11.8 60.3,12 63.3,12 64.5,6.4 69.7,10.7 71.8,10.8 78.8,11.8 88.1,3.9 88.5,7.8 69.7,6.4 66.8,32.9 64.1,32.9 11.4,12.44 11.4,11.24 24.1,7.3 15.4,10.7 25.9,48.3 17,48.3 6.8,45.6 46.4,31 47.4,31 49,30.2 48.3,31 45.1,31 40.8,31 46.6,22.8 46.6,25.1 57.2,22.4 94.2,25.4 25.8,14.8 28.1,17 38.7,17.1 33.4,14.7 44.7,14.7 79.4,8.4 75.6,12.2 69.6,3 62.2,3.3 55.6,9.7 57.9,42.9 57.1,47.9 56.1,47.9 74.6,46.8 69.3,47.1 77.2,36.1 98.6,30.7 98.5,36.2
  pour Top: 0,50 100,50 100,0 0,0
  pour Bottom: 0,50 100,50 100,0 0,0
LEFT
  Top 0.305: IC1.P$46 64.95,42.15 65.1,42.3 65.1,44.88 R11.1 65.25,44.55 68.7,48 JP5.3
MISO  (via drill 0.4)
  Top 0.305: IC2.16 69.41,17.21 69.9,17.7 71.3,17.7 72,18.4 72,20.27 J1.1 | J2.7(DAT0) 82.48,32.08 81.8,31.4 81.8,28.8 79.9,26.9 v70.7,26.9 v67.8,26.9 | IC1.P$30 59.55,35.15 59.8,34.9 v59.8,34.8
  Bottom 0.305: v70.7,26.9 70.7,21.57 J1.1 | v59.8,34.8 60.8,34.8 67.8,27.8 v67.8,26.9
MOSI  (via drill 0.4)
  Top 0.305: J2.3(CMD) 84.52,36.48 85.5,35.5 v85.5,35.2 | 75.2,26 75.2,20.1 74.1,19 J1.4 73.27,18.57 72,17.3 72,12.5 71.1,11.6 66.89,11.6 62,16.5 IC2.15 | 75.2,26 80.1,26 v82.8,28.7 | v67,26 75.2,26 | IC1.P$29 59.05,34.25 v59.4,33.9
  Bottom 0.305: v82.8,28.7 85.5,31.2 v85.5,35.2 | v59.4,33.9 59.4,31.5 60.5,30.4 64.4,30.4 67,27.8 v67,26
MP3-CS  (via drill 0.4)
  Top 0.305: IC2.10 v58,16.1 | IC1.P$23 57.45,38.15 v57.8,38.5
  Bottom 0.305: v57.8,38.5 58.1,38.2 64.1,38.2 74.6,27.9 74.6,16 73.9,15.3 61.5,15.3 60.7,16.1 v58,16.1
MP3-DCS  (via drill 0.4)
  Top 0.305: v54.1,43.7 54.65,43.15 IC1.P$13 | IC2.11 v58.8,15.3
  Bottom 0.305: v54.1,43.7 63.8,43.7 67.8,39.4 67.8,35.4 75.2,28.3 75.2,15.7 74.2,14.7 61.3,14.7 60.7,15.3 v58.8,15.3
MP3-DREQ  (via drill 0.4)
  Top 0.305: IC2.32 57.2,24.6 57.6,24.2 v57.7,24.2 | v59.1,42.9 59.05,42.95 IC1.P$8
  Bottom 0.305: v57.7,24.2 57.7,23.2 60,20.9 60,20 61.3,18.7 64.2,18.7 68.6,23.1 68.6,32.5 63.5,37.2 57.4,37.2 56.3,38.3 56.3,38.9 58.8,41.4 58.8,42.8 59,43 v59.1,42.9
MP3-RST  (via drill 0.4)
  Top 0.305: IC1.P$3 61.55,46.41 61.54,46.75 | 61.54,46.75 R10.1 | IC2.12 59.6,14.6 v59.5,14.4 | v62.6,46.3 61.99,46.3 61.54,46.75
  Bottom 0.305: v59.5,14.4 60.8,14.4 61.1,14.1 74.5,14.1 75.8,15.4 75.8,28.6 68.6,35.5 68.6,40.3 v62.6,46.3
N$1
  Top 0.305: IC2.14 61.2,15.9 61.7,15.4 LED2.A
N$2
  Top 0.305: JP3.6 85.8,2.4 86.2,2 89.06,2 C4.1
N$3
  Top 0.305: LED3.A 77.93,21.57 R14.2
N$4
  Top 0.305: IC2.28 60.4,27.9 61.6,29.1 78.4,29.1
  Top 0.406: R8.1 78.56,29.26 78.4,29.1
N$5
  Top 0.61: JP9.2 4.93,19.52 R18.1 8.5,18.6 12.45,15.05 IC6.1
N$6  (via drill 0.4)
  Top 0.305: 61.55,35.19 IC1.P$34 | 61.55,35.19 61.55,34.73 R6.1 61.05,34.77 IC1.P$33 | 61.55,35.19 61.57,35.2 62.4,35.2 62.55,35.36 IC1.P$36 63.35,36.15 v63.4,36.2 | IC1.P$25 56.35,36.15 56.3,36.1 v56.2,36.2
  Bottom 0.305: v56.2,36.2 v63.4,36.2
N$10
  Top 0.305: IC1.P$44 65.88,41.15 C11.1
N$11
  Top 0.305: U3.17 82.84,9.87 R15.1
N$12
  Top 0.305: IC1.P$26 57.55,34.38 R5.2
N$13
  Top 1.27: JP2.1 10,2 12.4,4.4 13.86,4.4 JP1.2
  Bottom 1.27: BAT1.+ 13.3,5.24 JP1.2
N$14
  Top 0.813: IC3.7 71.19,38.99 80.2,48 JP6.1
N$15
  Top 0.305: IC1.P$18 54.45,40.65 53.8,40 53.12,40 R2.1 50.83,40.02 50,39.2 X1.2 49.92,37.73 C2.1
N$16
  Top 0.305: C14.2 65.08,46.74 R11.2
N$17
  Top 0.305: R9.2 66.16,36.88 C12.1
N$18
  Top 0.406: R1.2 45.48,17.18 46.4,18.1 46.4,18.53 U1.1
N$19
  Top 0.305: IC1.P$17 54.35,41.15 53.8,41.7 53.17,41.7 R2.2 50.92,41.77 50,42.7 50,43.98 | 50,43.98 X1.1 | C3.1 49.91,44.08 50,43.98
N$20
  Top 0.406: 3.38,24.38 JP9.1 | 8.53,24.4 C30.2
  Top 0.61: C30.2 3.38,24.38 | IC6.7 14.27,19.77 13.8,19.3 11.8,19.3 11.2,19.9 11.2,22.4 9.2,24.4 8.53,24.4
N$21
  Top 0.406: IC6.6 15.54,23.86 14.6,24.8 10.9,24.8 10.2,25.5 2.4,25.5 1.3,24.4 1.3,12.16 VR1.2
N$22
  Top 0.305: C17.1 79.28,41.74 IC3.3
N$23  (via drill 0.4)
  Top 0.406: C16.2 75.19,44.98 v75.2,44.7 75.2,44.8
  Bottom 0.406: v75.2,44.7 75.2,42.34 IC3.2
N$24
  Top 0.305: C15.1 73.42,45.74 73.42,45.75 | 73.42,45.75 C16.1 | JP5.2 73.46,45.78 73.42,45.75
N$25
  Top 0.406: C28.1 R16.2
N$26
  Top 0.406: C29.1 R17.2
N$27
  Top 0.406: C30.1 R18.2
N$29
  Top 0.813: JP6.2 84.54,47.94 81.7,45.1 81.7,39.08 IC3.1
N$31
  Top 0.406: R4.1 39.31,24.77 LED1.A
N$37
  Top 0.406: 8.62,29.45 R17.1
  Top 0.61: R17.1 3.73,29.32 JP8.2 | IC5.1 8.62,29.45
N$38
  Top 0.406: 8.78,33.9 C29.2
  Top 0.61: IC5.7 14.27,34.37 13.8,33.9 8.78,33.9 | C29.2 4.58,34.17 JP8.1
N$39
  Top 0.406: 8.53,39 R16.1
  Top 0.61: R16.1 3.56,39.02 JP7.2 | IC4.1 11.05,40.75 9.3,39 8.53,39
N$40
  Top 0.406: 14.3,46.41 IC4.7
  Top 0.61: JP7.1 5.88,43.88 C28.2 12.57,43.88 14.3,45.6 14.3,46.41
PIO1
  Top 0.305: U3.10 79.57,20.07 78.6,19.1 78.25,19.1 R14.1
RIN1  (via drill 0.4)
  Top 0.305: IC2.24 64.9,24.3 65.1,24.5 v65.1,25.9
  Top 0.406: IC4.5 v16.8,44.6
  Bottom 0.305: v65.1,25.9 65.1,26.6 62.8,28.9 31.7,28.9 v16.8,44.6
RIN2  (via drill 0.4)
  Top 0.305: IC2.26 v62,26.9
  Top 0.406: v16.8,32.1 IC5.5
  Bottom 0.305: v62,26.9 61.5,27.4 21.5,27.4 v16.8,32.1
  Bottom 0.406: 16.8,32.2 v16.8,32.1
RIN3  (via drill 0.4)
  Top 0.305: IC2.19 62.5,20.3 v62.2,20.1
  Top 0.406: v16.8,23.2 IC6.5
  Bottom 0.305: v62.2,20.1 61.3,21 61.3,23.3 58.2,26.4 19.9,26.4 16.8,23.3
  Bottom 0.406: 16.8,23.3 v16.8,23.2
RST  (via drill 0.4)
  Top 0.305: v58.1,20.2 59.6,21.7 IC2.29 59.6,27.64 R3.2 | C4.2 90.81,2.08 90.8,2.1 90.8,1.3 90.2,0.7 71.3,0.7 70.7,1.4 v70.7,7.6 | v70.7,12.4 70.7,14.63 J1.5
  Bottom 0.305: v58.1,20.2 58.1,19.8 61.4,16.5 70.69,16.5 | v70.7,7.6 v70.7,12.4
  Bottom 0.406: 70.69,16.5 J1.5
RXD  (via drill 0.4)
  Top 0.305: IC2.30 58.8,26.7 58.2,27.3 54.1,27.3 50.1,23.3 50.1,18.2 v51.8,16.5
  Bottom 0.305: JP3.4 78.2,4.8 63.6,4.8 v51.8,16.5
SCK  (via drill 0.4)
  Top 0.305: IC2.17 70.43,18.7 J1.3 | v77.2,27.9 v69.4,27.9 v65.7,27.9 | v58.3,33.6 58.55,33.85 IC1.P$28
  Top 0.406: J2.5(CLK) 84.42,34.28 v84.6,34.2
  Bottom 0.305: v84.6,34.2 82.7,34.2 77.2,28.7 v77.2,27.9 | v69.4,27.9 69.4,20.33 J1.3 | v58.3,33.6 58.3,31.8 60.2,29.9 63.7,29.9 v65.7,27.9
SD-CS  (via drill 0.4)
  Top 0.305: IC2.13 v60.4,13.6 | v85.1,37.6 83.38,37.6 J2.2(CD/DAT3)
  Bottom 0.305: v60.4,13.6 74.8,13.6 76.4,15.2 76.4,28.8 v85.1,37.6
SHUTDOWN
  Top 0.406: LED2.K R7.1
TXD  (via drill 0.4)
  Top 0.305: v52.2,17.4 50.7,18.9 50.7,23.1 54.4,26.8 57.7,26.8 58,26.5 IC2.31
  Bottom 0.305: JP3.5 80.16,5.4 64.2,5.4 v52.2,17.4
VCC
  Top 0.305: IC3.8
  Top 0.406: C25.1 14.73,39.33 14.61,39.21 | 14.59,37.77 C22.1 | 14.86,28.06 C26.1 | 14.78,26.52 C23.1 | C24.1 15.18,12.32 | R1.1 43.73,17.48 42.8,18.4
  Top 0.508: IC4.2 14.27,39.79 14.73,39.33 | IC4.3 15.54,40.04 C25.1 | IC5.2 14.27,28.66 14.86,28.06 15.54,28.73 IC5.3 | IC6.2 14.27,14.46 C27.1 15.54,14.01 IC6.3
  Top 0.61: 14.59,37.77 14.61,39.21 | C26.1 14.78,26.52 | C27.1 15.18,12.32
  Top 0.813: IC3.8 C19.1 69.78,31.21 70.2,30.8 70.9,30.8 C20.+
  Top 1.27: VR1.1 8.92,4.54 JP2.2 9,5 11.3,7.3 14.2,7.3 15.9,9 C21.+ | C21.+ 17,11.7 | 17,11.7 16.5,12.2 C24.1 | 17,11.7 17.3,11.7 19.2,13.6 19.2,26.61 | 19.2,26.61 19.2,36 17.4,37.8 14.62,37.8 14.59,37.77 | C23.1 18.99,26.4 19.2,26.61 | C21.+ 18.2,9 22.6,13.4 | 22.6,13.4 27.6,18.4 39.47,18.4 C1.2 42.58,18.43 42.8,18.4 43.01,18.4 U1.5 | C20.+ 68.9,31 68.4,31.5 56.8,31.5 48.4,23.1 48.4,16.5 45.3,13.4 22.6,13.4
VREF1  (via drill 0.4)
  Top 0.305: IC4.6 15.54,47.47 15.5,47.5 v15.5,47.6 | v58.6,23.5 58.4,23.4 57.2,23.4 56.3,24.3 IC2.1
  Bottom 0.305: v15.5,47.6 15.5,47.5 33.4,29.4 63.1,29.4 66.1,26.4 66.1,21.4 64,19.3 61.7,19.3 60.6,20.4 60.6,21.5 v58.6,23.5
VREF2  (via drill 0.4)
  Top 0.305: IC5.6 15.54,36.13 15.6,36.2 v15.6,36.3 | IC2.9 57.2,18 57.4,18.2 59.1,18.2 62,21.1 v62.8,21.1
  Bottom 0.305: v15.6,36.3 22,36.3 30.2,27.9 62.2,27.9 63.7,26.4 63.7,22 v62.8,21.1
WAKE_HW
  Top 0.305: R12.2 U3.15
WAKE_SW
  Top 0.305: R13.2 84.04,24.34 U3.7

### Text on the board
tPlace: VR2 | Speaker | M1 | M2 | M3 | GND | GND | hemisphere_robo / KENBISHI | BAT2 | SWITCH